# Altium project PCB_Project1.PrjPCB
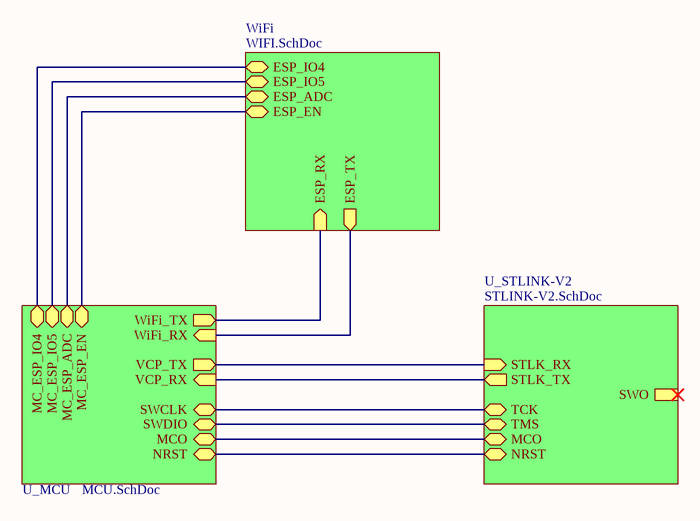
[diagram p0: Main.SchDoc]
4 sheets, 73 parts. Net scope: hierarchical (ports join the sheet entries above them; power ports are global).
Board file: PCB1.PcbDoc
Sheets:
  Main.SchDoc
    U_MCU = MCU.SchDoc
    U_STLINK-V2 = STLINK-V2.SchDoc
    WiFi = WIFI.SchDoc

## Sheet Main.SchDoc
size A

### Sub-sheets
U_MCU = MCU.SchDoc: VCP_TX (out), VCP_RX (in), SWCLK (bidir), SWDIO (bidir), MCO (bidir), NRST (bidir), WiFi_TX (out), WiFi_RX (in), MC_ESP_IO4 (bidir), MC_ESP_IO5 (bidir), MC_ESP_ADC (bidir), MC_ESP_EN (bidir)
U_STLINK-V2 = STLINK-V2.SchDoc: STLK_RX (in), STLK_TX (out), TCK (bidir), TMS (bidir), MCO (bidir), NRST (bidir), SWO
WiFi = WIFI.SchDoc: ESP_RX (in), ESP_TX (out), ESP_IO4 (bidir), ESP_IO5 (bidir), ESP_ADC (bidir), ESP_EN (bidir)

### Nets
MCO: sheet U_MCU/MCO, sheet U_STLINK-V2/MCO
PA9: sheet U_MCU/WiFi_TX, sheet WiFi/ESP_RX
PA10: sheet U_MCU/WiFi_RX, sheet WiFi/ESP_TX
STLINK RX: sheet U_MCU/VCP_TX, sheet U_STLINK-V2/STLK_RX
STLINK TX: sheet U_MCU/VCP_RX, sheet U_STLINK-V2/STLK_TX
NetC13_2: sheet U_MCU/NRST, sheet U_STLINK-V2/NRST
NetJ6_2: sheet U_MCU/MC_ESP_EN, sheet WiFi/ESP_EN
NetP3_18: sheet U_MCU/MC_ESP_ADC, sheet WiFi/ESP_ADC
NetP3_19: sheet U_MCU/MC_ESP_IO5, sheet WiFi/ESP_IO5
NetP3_20: sheet U_MCU/MC_ESP_IO4, sheet WiFi/ESP_IO4
NetR11_1: sheet U_MCU/SWCLK, sheet U_STLINK-V2/TCK
NetR14_2: sheet U_MCU/SWDIO, sheet U_STLINK-V2/TMS

## Sheet MCU.SchDoc
size A
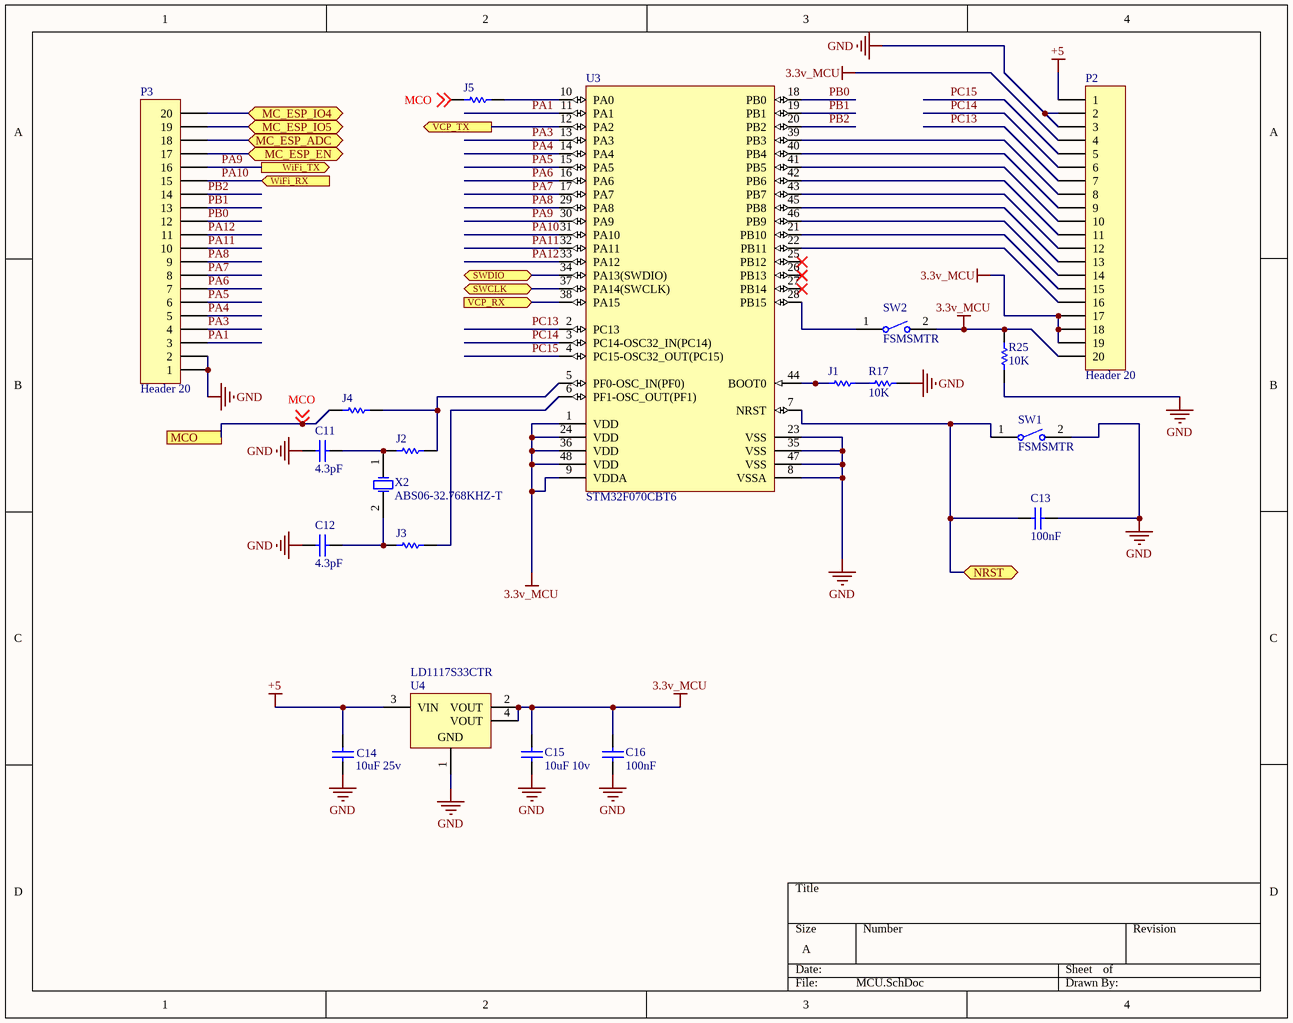
[diagram p1: MCU.SchDoc]

### Parts
C11  4.3pF  [CAPC0603(1608)100_L]
C12  4.3pF  [CAPC0603(1608)100_L]
C13  100nF  [CAPC0603(1608)100_L]
C14  10uF 25v  [CAPC0805(2012)145_L]
C15  10uF 10v  [CAPC0805(2012)145_L]
C16  100nF  [CAPC0603(1608)100_L]
J1  (no value)  [RESC1608X55X30LL10T20_A]
J2  (no value)  [RESC1608X55X30LL10T20_A]
J3  (no value)  [RESC1608X55X30LL10T20_A]
J4  (no value)  [RESC1608X55X30LL10T20_A]
J5  (no value)  [RESC1608X55X30LL10T20_A]
P2  Header 20  [HDR1X20]
P3  Header 20  [HDR1X20]
R17  10K  [RESC1609X55X30LL15T15]
R25  10K  [RESC1609X55X30LL15T15]
SW1  FSMSMTR  [TECO-FSMSMTR_V]
SW2  FSMSMTR  [TECO-FSMSMTR_V]
U3  STM32F070CBT6  [STM-LQFP48_N]
U4  LD1117S33CTR  [SOT-223_N]
X2  ABS06-32.768KHZ-T  [ABRA-ABS06-2_V]

### Ports
MC_ESP_ADC (bidir), MC_ESP_EN (bidir), MC_ESP_IO4 (bidir), MC_ESP_IO5 (bidir), MCO, NRST (bidir), SWCLK (bidir), SWDIO (bidir), VCP_RX (in), VCP_TX (out), WiFi_RX (in), WiFi_TX (out)

### Nets
3.3v_MCU: C15.2 C16.2 P2.4 P2.17 P2.18 P2.19 P2.20 R25.2 SW2.2 U3.1(VDD) U3.9(VDDA) U3.24(VDD) U3.36(VDD) U3.48(VDD) U4.2(VOUT) U4.4(VOUT)
+5: C14.2 P2.1 U4.3(VIN)
GND: C11.1 C12.1 C13.1 C14.1 C15.1 C16.1 P2.2 P2.3 P3.1 P3.2 R17.2 R25.1 SW1.2 U3.8(VSSA) U3.23(VSS) U3.35(VSS) U3.47(VSS) U4.1(GND)
MCO: J4.1 J5.1 ; off-sheet MCO, port MCO
PA1: P3.3 U3.11(PA1)
PA3: P3.4 U3.13(PA3)
PA4: P3.5 U3.14(PA4)
PA5: P3.6 U3.15(PA5)
PA6: P3.7 U3.16(PA6)
PA7: P3.8 U3.17(PA7)
PA8: P3.9 U3.29(PA8)
PA9: P3.16 U3.30(PA9) ; port WiFi_TX
PA10: P3.15 U3.31(PA10) ; port WiFi_RX
PA11: P3.10 U3.32(PA11)
PA12: P3.11 U3.33(PA12)
PB0: P3.12 U3.18(PB0)
PB1: P3.13 U3.19(PB1)
PB2: P3.14 U3.20(PB2)
PC13: P2.7 U3.2(PC13)
PC14: P2.6 U3.3(PC14-OSC32_IN(PC14))
PC15: P2.5 U3.4(PC15-OSC32_OUT(PC15))
STLINK RX: U3.12(PA2) ; port VCP_TX
STLINK TX: U3.38(PA15) ; port VCP_RX
NetC11_2: C11.2 J2.1 X2.1(X1)
NetC12_2: C12.2 J3.1 X2.2(X2)
NetC13_2: C13.2 SW1.1 U3.7(NRST) ; port NRST
NetJ1_1: J1.1 U3.44(BOOT0)
NetJ1_2: J1.2 R17.1
NetJ2_2: J2.2 J4.2 U3.5(PF0-OSC_IN(PF0))
NetJ3_2: J3.2 U3.6(PF1-OSC_OUT(PF1))
NetJ5_2: J5.2 U3.10(PA0)
NetJ6_2: P3.17 ; port MC_ESP_EN
NetP2_8: P2.8 U3.39(PB3)
NetP2_9: P2.9 U3.40(PB4)
NetP2_10: P2.10 U3.41(PB5)
NetP2_11: P2.11 U3.42(PB6)
NetP2_12: P2.12 U3.43(PB7)
NetP2_13: P2.13 U3.45(PB8)
NetP2_14: P2.14 U3.46(PB9)
NetP2_15: P2.15 U3.21(PB10)
NetP2_16: P2.16 U3.22(PB11)
NetP3_18: P3.18 ; port MC_ESP_ADC
NetP3_19: P3.19 ; port MC_ESP_IO5
NetP3_20: P3.20 ; port MC_ESP_IO4
NetR11_1: U3.37(PA14(SWCLK)) ; port SWCLK
NetR14_2: U3.34(PA13(SWDIO)) ; port SWDIO
NetSW2_1: SW2.1 U3.28(PB15)

Not connected (* = marked no-connect by the designer): U3 25(PB12)* 26(PB13)* 27(PB14)*

### Library data of the parts
C11 C12 = CMP-1035-00303-1: CAP 4.3pF 25V ±0.5pF 0603 (1608 Metric) Thickness 1mm SMD; Case-EIA: 0603; Tolerance: Â±0.5pF; Case-Metric: 1608; Value: 4.3pF; Technology: SMT; Max Thickness: 1 mm; Rated Voltage: 25 V
C13 C16 = CMP-1035-02583-1: CAP 100nF 16V ±5% 0603 (1608 Metric) Thickness 1mm SMD; Tolerance: Â±5%; Case-Metric: 1608; Case-EIA: 0603; Rated Voltage: 16 V; Max Thickness: 1 mm; Technology: SMT; Value: 100nF
C14 = CMP-1036-04932-1: CAP 10uF 25V ±10% 0805 (2012 Metric) Thickness 1.45mm SMD; Case-EIA: 0805; Case-Metric: 2012; Tolerance: Â±10%; Technology: SMT; Value: 10uF; Rated Voltage: 25 V; Max Thickness: 1.45 mm
C15 = CMP-1036-04926-1: CAP 10uF 10V -20% to +80% 0805 (2012 Metric) Thickness 1.45mm SMD; Case-EIA: 0805; Case-Metric: 2012; Technology: SMT; Max Thickness: 1.45 mm; Rated Voltage: 10 V; Value: 10uF; Tolerance: -20% to +80%
J1-J5 = CMP-2000-06686-1: Chip Resistor, 0 Ohm, +/- 5%, 100 mW, -55 to 155 degC, 0603 (1608 Metric), RoHS, Tape and Reel; Manufacturer: Rohm; Tolerance: Jumper; Power (Watts): 0.1W,1/10W; Resistance (Ohms): 0.0; Online Catalog: MCR03Series; EDA / CAD Models: DownloadfromAcceleratedDesigns; Other Names: RHM0.0CGTR; Series: MCR; Package Description: 2-Pin Surface Mount Device, Body 1.60 x 0.80 mm; Composition: ThickFilm; Height: 0.022"(0.55mm); Mounting Technology: SurfaceMount; Family: ChipResistor-SurfaceMount; Temperature Coefficient: -; Category: Resistors; Supplier Device Package: 0603(1608Metric); Package Reference: 0603; Size / Dimension: 0.063"Lx0.031"W(1.60mmx0.80mm); Standard Package: 5,000; Datasheet URL: http://www.rohm.com/web/global/datasheet/MCR03ERTJ; Features: -; Datasheet Version: Rev. F, 02/2015; Operating Temperature: -55°C~155°C; Package / Case: 0603(1608Metric); Manufacturer URL: http://www.rohm.com/web/global/; Packaging: Tape&Reel(TR); Number of Terminations: 2
P2 P3 = Header 20: Header, 20-Pin; LatestRevisionDate: 17-Jul-2002; LatestRevisionNote: Re-released for DXP Platform.; Publisher: Altium Limited
R17 R25 = CMP-2000-07452-1: Chip Resistor, 10 KOhm, +/- 1%, 0.1 W, -55 to 155 degC, 0603 (1608 Metric), RoHS, Tape and Reel; Manufacturer: Panasonic; Voltage Rating: 75V; Case\/Package: 0603; Power Rating: 100mW; Resistance: 10KOhm; Temperature Coefficient: 100ppm\/degreesC; Number of Pins: 2; Package Reference: 603; Depth: 0.8mm; Mount: SurfaceMount; Package Description: 2-Pin Surface Mount Device, Body 1.6 x 0.85 mm; Datasheet Version: 02/2017; Length: 1.6mm; Lead Free: LeadFree; Height: 0.45mm; Number of Terminations: 2; Max Power Dissipation: 100mW; Min Operating Temperature: -55degC; Datasheet URL: https://industrial.panasonic.com/cdbs/www-data/pdf/RDA0000/AOA0000C304.pdf; Termination: SMD/SMT; Case Code (Metric): 1608; Case Code (Imperial): 0603; Tolerance: 1%; Max Operating Temperature: 155degC; RoHSCompliant: true; Voltage Rating (DC): 75V; Radiation Hardening: No; Packaging: TapeandReel; Composition: ThickFilm; Mounting Technology: SurfaceMount; Manufacturer URL: http://www.panasonic.com/; Width: 0.031inch; REACH SVHC: NoSVHC; Contact Plating: Tin; Military Standard: Not; Package Quantity: 1
SW1 SW2 = CMP-2000-07501-1: FSMSM Push Button Switch, 50 mA, -35 to 85 degC, 2-Pin SMD, RoHS, Tape and Reel; Manufacturer: TE Connectivity; Voltage Rating (DC): 24V; Electrical Life: 20000Cycles; Operating Force: 180gf; Switch Travel: 0.25mm; Contact Current Rating: 50mA; Case\/Package: SMD/SMT; Actuator Length: 1.07mm; Throw Configuration: SPST; Actuator Material: Polyamide; Contact Resistance: 100mOhm; Illumination Type: Illuminated; Max Voltage Rating (DC): 12V; Manufacturer URL: http://www.te.com/; Lead Free: LeadFree; Packaging: TapeandReel; Min Operating Temperature: -35degC; Mechanical Life: 20000Cycles; Mount: SurfaceMount; REACH SVHC: Unknown; Package Quantity: 1800; Package Reference: FSMSMTR; RoHSCompliant: true; Max Operating Temperature: 85degC; Orientation: Straight; ELV: Compliant; Datasheet URL: http://www.te.com/commerce/DocumentDelivery/DDEController?Action=showdoc&DocId=Customer+Drawing%7F1437566-3%7FC2%7Fpdf%7FEnglish%7FENG_CD_1437566-3_C2_1437566_3_1_c.dwg.pdf%7F1437566-4; Package Description: 2-Pin Surface Mount Device, Body 6 x 3.5 mm, Pitch 9.19 mm; Current Rating: 50mA; Contact Plating: Silver; Termination: GullWing; Datasheet Version: Rev. C2, 08/2014; Contact Material: Brass; Mounting Technology: SurfaceMount
U3 = CMP-0304-00143-1: ARM Cortex-M0 32-bit MCU, 128 KB Flash, 16 KB Internal RAM, 37 I/Os, 48-Pin LQFP, -40 to 85 degC, Tray; I/Os (High Current): 37; FLASH Size (Prog) (kB): 128; Operating Frequency(F) (Processor speed) (MHz): 48; Internal RAM Size (kB): 16; Supply Voltage(Vcc) min (V): 2.4; Package Description: 48-Pin Low Profile Quad Flat Package, Body 7 x 7 mm, Pitch 0.5 mm; Mounting Technology: Surface Mount; DatasheetVersion: Rev. 3; ComponentLink1Description: Manufacturer URL; Package Reference: LQFP48; Core: ARM Cortex-M0; ComponentLink1URL: http://www.st.com/; Packing: Tray; ComponentLink2Description: Datasheet; ComponentLink2URL: http://www.st.com/st-web-ui/static/active/en/resource/technical/document/datasheet/DM00141386.pdf
U4 = CMP-0244-00307-1: Fixed Low Drop Positive Voltage Regulator, 3.3V, 4-Pin SOT-223, Tape and Reel; ComponentLink1URL: http://www.st.com; PackageVersion: 2010; ComponentLink1Description: Manufacturer URL; DatasheetVersion: 1/11/2011; ComponentLink2URL: http://www.st.com/internet/com/TECHNICAL_RESOURCES/TECHNICAL_LITERATURE/DATASHEET/CD00000544.pdf; PackageReference: SOT-223; ComponentLink2Description: Datasheet; PackageDescription: 4-Pin SOT-223 Package, 6.5 x 3.5 mm Body, 2.3 mm Pitch, 7 mm Lead Span
X2 = CMP-2000-05035-1: Low Profile Crystal, 32.768 KHz, -40 to 85 degC, 2-Pin SMD, RoHS, Tape and Reel; Brand: ABRACON; Tolerance: 20PPM; Case Height: 0.6mm; Case Length: 2mm; Case Width: 1.2mm; ESR: 90kOhms; Load Capacitance: 12.5pF; Series: ABS06; Manufacturer URL: http://www.abracon.com/; RoHS: Details; Datasheet URL: http://www.mouser.com/ds/2/3/ABS06-10798.pdf; Package / Case: 2-SMD; Mounting Style: SMD/SMT; Type: LowProfileCrystal; Product Category: Crystals; Datasheet Version: Sep-15; Frequency Stability: 20PPM; Packaging: Reel; Frequency: 32.768kHz; Operating Temperature Range: -40Cto+85C; Package Description: 2-Pin Surface Mounted Device, Body 2 x 1.2 mm, Height 0.6 mm; Dimensions: 1.2mmWx2mmLx0.6mmH; Package Reference: ABS06; Manufacturer: ABRACON; Termination Style: SMD/SMT; Factory Pack Quantity: 3000

## Sheet STLINK-V2.SchDoc
size A
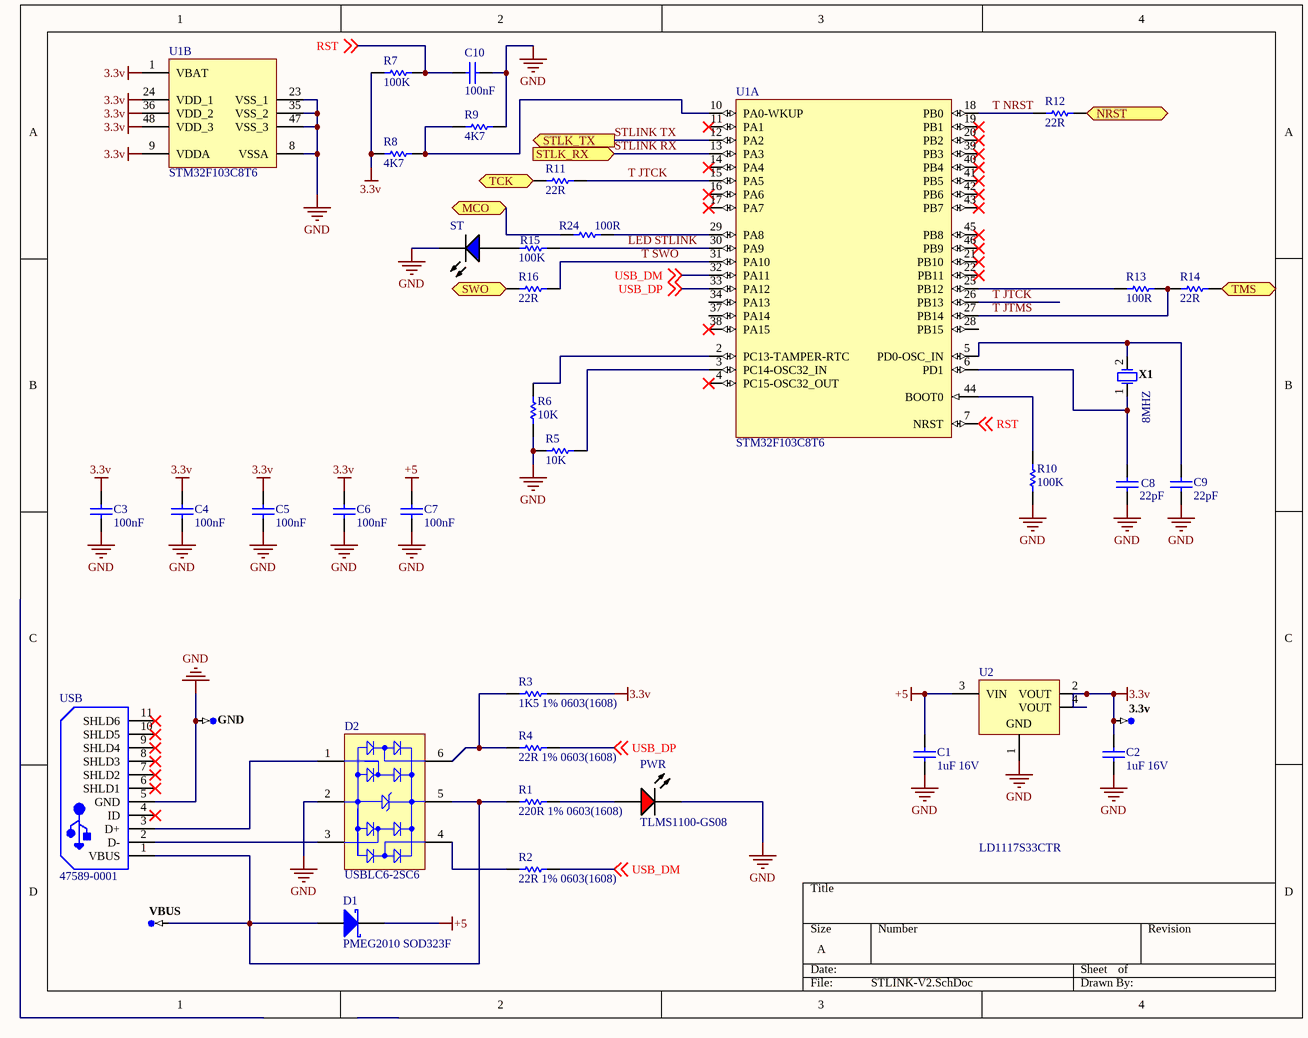
[diagram p2: STLINK-V2.SchDoc]

### Parts
3.3v  (no value)  [TP-SM-C-100]  (no BOM)
C1  1uF 16V  [CAPC0603(1608)100_L]
C2  1uF 16V  [CAPC0603(1608)100_L]
C3  100nF  [CAPC0603(1608)100_L]
C4  100nF  [CAPC0603(1608)100_L]
C5  100nF  [CAPC0603(1608)100_L]
C6  100nF  [CAPC0603(1608)100_L]
C7  100nF  [CAPC0603(1608)100_L]
C8  22pF  [CAPC0603(1608)100_L]
C9  22pF  [CAPC0603(1608)100_L]
C10  100nF  [CAPC0603(1608)100_L]
D1  PMEG2010 SOD323F  [NXP-SOD323F_V]
D2  USBLC6-2SC6  [STM-SOT23-6L_V]
GND  (no value)  [TP-SM-C-100]  (no BOM)
PWR  TLMS1100-GS08  [VISH-TLMX1100_V]
R1  220R 1% 0603(1608)  [RESC0603(1608)_L]
R2  22R 1% 0603(1608)  [RESC0603(1608)_L]
R3  1K5 1% 0603(1608)  [RESC0603(1608)_L]
R4  22R 1% 0603(1608)  [RESC0603(1608)_L]
R5  10K  [RESC1609X55X30LL15T15]
R6  10K  [RESC1609X55X30LL15T15]
R7  100K  [RESC0603(1608)_L]
R8  4K7  [RESC0603(1608)_L]
R9  4K7  [RESC0603(1608)_L]
R10  100K  [RESC0603(1608)_L]
R11  22R  [RESC0603(1608)_L]
R12  22R  [RESC0603(1608)_L]
R13  100R  [RESC0603(1608)_L]
R14  22R  [RESC0603(1608)_L]
R15  100K  [RESC0603(1608)_L]
R16  22R  [RESC0603(1608)_L]
R24  100R  [RESC0603(1608)_L]
ST  (no value)  [ROHM-SMLE12BC7TT86_V]
U1  STM32F103C8T6  [LQFP48_N]  (parts A,B of 2)
U2  LD1117S33CTR  [SOT-223_N]
USB  47589-0001  [MOLX-47589-0001_V]
VBUS  (no value)  [TP-SM-C-100]  (no BOM)
X1  8MHZ  [NDK-NX3225GD-8MHZ-STD-CRA-3_V]

### Ports
MCO (bidir), NRST (bidir), STLK_RX (in), STLK_TX (out), SWO (bidir), TCK (bidir), TMS (bidir)

### Nets
3.3v: 3.3v.1 C2.2 C3.2 C4.2 C5.2 C6.2 R3.2 R7.1 R8.1 U1.1(VBAT) U1.9(VDDA) U1.24(VDD_1) U1.36(VDD_2) U1.48(VDD_3) U2.2(VOUT) U2.4(VOUT)
+5: C1.2 C7.2 D1.1(K) U2.3(VIN)
GND: C1.1 C2.1 C3.1 C4.1 C5.1 C6.1 C7.1 C8.1 C9.1 C10.1 D2.2(GND) GND.1 PWR.2(K) R5.1 R6.1 R9.2 R10.1 ST.2(K) U1.8(VSSA) U1.23(VSS_1) U1.35(VSS_2) U1.47(VSS_3) U2.1(GND) USB.5(GND)
LED STLINK: R15.2 U1.30(PA9)
MCO: R24.1 ; port MCO
RST: C10.2 R7.2 U1.7(NRST) ; off-sheet RST
STLINK RX: U1.13(PA3) ; port STLK_RX
STLINK TX: U1.12(PA2) ; port STLK_TX
T JTCK: R11.2 U1.15(PA5) U1.26(PB13)
T JTMS: R13.2 R14.1 U1.27(PB14)
T NRST: R12.1 U1.18(PB0)
T SWO: R16.2 U1.31(PA10)
USB_DM: R2.2 U1.32(PA11) ; off-sheet USB_DM
USB_DP: R4.2 U1.33(PA12) ; off-sheet USB_DP
NetC8_2: C8.2 U1.6(PD1) X1.1
NetC9_2: C9.2 U1.5(PD0-OSC_IN) X1.2
NetC13_2: R12.2 ; port NRST
NetD1_2: D1.2(A) D2.5(VBUS) R1.1 USB.1(VBUS) VBUS.1
NetD2_1: D2.1(I/O_1) USB.3(D+)
NetD2_3: D2.3(I/O_2) USB.2(D-)
NetD2_4: D2.4(I/O_3) R2.1
NetD2_6: D2.6(I/O_4) R3.1 R4.1
NetPWR_1: PWR.1(A) R1.2
NetR5_2: R5.2 U1.3(PC14-OSC32_IN)
NetR6_2: R6.2 U1.2(PC13-TAMPER-RTC)
NetR8_2: R8.2 R9.1 U1.10(PA0-WKUP)
NetR10_2: R10.2 U1.44(BOOT0)
NetR11_1: R11.1 ; port TCK
NetR13_1: R13.1 U1.25(PB12)
NetR14_2: R14.2 ; port TMS
NetR15_1: R15.1 ST.1(A)
NetR16_1: R16.1 ; port SWO
NetR24_2: R24.2 U1.29(PA8)

Not connected (* = marked no-connect by the designer): U1 4(PC15-OSC32_OUT)* 11(PA1)* 14(PA4)* 16(PA6)* 17(PA7)* 19(PB1)* 20(PB2)* 21(PB10)* 22(PB11)* 28(PB15) 34(PA13) 37(PA14) 38(PA15)* 39(PB3)* 40(PB4)* 41(PB5)* 42(PB6)* 43(PB7)* 45(PB8)* 46(PB9)*; USB 4(ID)* 6(SHLD1)* 7(SHLD2)* 8(SHLD3)* 9(SHLD4)* 10(SHLD5)* 11(SHLD6)*

### Library data of the parts
3.3v GND VBUS = CMP-0484-00002-2: Test Point, Surface Mount, Circular, Pad Diameter 1 mm; Manufacturer: No Vendor; PartNumber: TP-SM-C-100
C1 C2 = CMP-1035-02736-1: CAP 1uF 16V ±5% 0603 (1608 Metric) Thickness 1mm SMD; Case-Metric: 1608; Case-EIA: 0603; Tolerance: Â±5%; Technology: SMT; Max Thickness: 1 mm; Rated Voltage: 16 V; Value: 1uF
C3-C7 C10 = CMP-1035-02583-1: as C13 on sheet MCU; Rated Voltage: 16 V; Max Thickness: 1 mm; Technology: SMT; Value: 100nF
C8 C9 = CMP-1035-00815-1: CAP 22pF 25V ±10% 0603 (1608 Metric) Thickness 1mm SMD; Case-Metric: 1608; Case-EIA: 0603; Tolerance: Â±10%; Max Thickness: 1 mm; Rated Voltage: 25 V; Technology: SMT; Value: 22pF
D1 = CMP-2000-06909-1: Very Low Forward Voltage MEGA Schottky Barrier Rectifier, 1 A, 660 mV, -65 to 150 degC, 2-Pin SOD323F, RoHS, Tape and Reel; Manufacturer: NXP; Speed: FastRecovery=200mA(Io); Package Version: 02/2016; Capacitance @ Vr, F: 68pF@1V,1MHz; PCN Design/Specification: ResinHardener02/Jul/2013BondWiringChg06/Sep/2015BondingWireRevision28/Sep/2015SOD323FBondWireAutoCu&2ndSourceMoldComp2/Nov/2015; Current - Average Rectified (Io): 1A(DC); Other Names: 568-4138-1; Voltage - Forward (Vf) (Max) @ If: 660mV@1A; Current - Reverse Leakage @ Vr: 50µA@60V; Online Catalog: SchottkyDiode; Kits: NXPMEGA1-KIT-ND-KITSCHOTTKYDIODE17VALUES; PCN Packaging: LighterReels02/Jan/2014; Voltage - DC Reverse (Vr) (Max): 60V; Diode Type: Schottky; Package Description: 2-Pin Small Outline Diode Flat Lead, Body 1.7 x 1.35 mm; Datasheet URL: https://datasheet.ciiva.com/913/pmeg6010ceh-pmeg6010cej-913504.pdf; Mounting Technology: SurfaceMount; Package Reference: SOD323F; Packaging: CutTape(CT); Manufacturer URL: http://www.nxp.com/; Supplier Device Package: SOD-323F; Reverse Recovery Time (trr): -; Standard Package: 1; Category: DiscreteSemiconductorProducts; Family: Diodes,Rectifiers-Single; Mounting Type: SurfaceMount; Datasheet Version: Rev. 02, 03/2007; Operating Temperature - Junction: 150°C(Max); Series: -; Package / Case: SC-90,SOD-323F; Package URL: http://www.nxp.com/documents/outline_drawing/SOD323F.pdf
D2 = CMP-2000-05378-1: Very low capacitance ESD protection, 3.5 pF, -40 to 125 degC, 6-Pin SOT23, RoHS, Tape and Reel; Manufacturer: STMicroelectronics; Polarity: Uni-Directional; Clamping Voltage: 17V; Rad Hardened: No; Product Height (mm): 1.3mm; Leakage Current (Max): 0.15uA; Product Length (mm): 3.05mm; Number of Elements: 1; Peak Pulse Current: 5A; Configuration: Dual; Reverse Breakdown Voltage: 6V; Working Voltage (Max): 5V; Capacitance Value: 3.5pF; Suppressor Type: DiodeArrays; Product Depth (mm): 1.75mm; Test Current (It): 1mA; Package / Case: SOT-23; Operating Temperature Max Deg. C: 125C; Package Description: 6-Pin Small Outline Transistor, Body 2.925 x 1.625 mm, Pitch 0.95 mm; Package Reference: SOT23-6L; Datasheet Version: Rev. 5, 10/2011; Operating Temperature Min Deg. C: -40C; Mounting Style: SurfaceMount; Direction Type: Uni-Directional; Mounting: SurfaceMount; Pin Count: 6; Leakage Current: 0.15uA; Packaging: TapeandReel; Operating Temperature Classification: Automotive; Clamping Voltage (Max): 17V; Manufacturer URL: http://www.st.com/; Reverse Stand-off Voltage: 5V; Datasheet URL: http://www.st.com/st-web-ui/static/active/en/resource/technical/document/datasheet/CD00050750.pdf; Working Voltage: 5V; Operating Temp Range: -40Cto125C
PWR = CMP-1666-00027-1: LED, RED, 2.1 V, -40 to 100 degC, 2-Pin SMD (0603), RoHS, Tape and Reel; Type (Capacitors): C0G; Resistance: 100000000000 Ohm; Capacitance: 12 pF; Voltage Rating: 50 V; Tolerance: 5%; Min Operating Temperature: -55degC; REACH SVHC: No SVHC; ComponentLink2Description: Datasheet; ComponentLink1URL: http://www.vishay.com/; Width: 0.8 mm; Package Quantity: 4000; PackageReference: TLMX1100; ComponentLink2URL: http://www.vishay.com/docs/83173/tlmb1100.pdf; Case/Package: 0603; Case Code (Metric): 1608; Packaging: Tape and Reel; Pins: 2; ComponentLink1Description: Manufacturer URL; Max Operating Temperature: 125degC; Height: 0.8 mm; Length: 1.6 mm; Mount: Surface Mount; PackageDescription: 2-Pin Surface Mount Device, Body 1.6 x 0.8 mm; DatasheetVersion: Rev. 2.7, 03/2016; Case Code (Imperial): 0603; Voltage Rating (DC): 50 V; RoHSCompliant: True; Radiation Hardening: No
R1 = CMP-1012-00433-1: 220R 0.1W 1% 0603 (1608 Metric)  SMD; Value: 220.00 Ohm; Case-EIA: 0603; Case-Metric: 1608; Technology: SMT; Tolerance: 1 %; Power: 0.1 W
R2 R4 R11 R12 R14 R16 = CMP-1012-00320-1: 22R 0.1W 1% 0603 (1608 Metric)  SMD; Value: 22.00 Ohm; Case-EIA: 0603; Case-Metric: 1608; Power: 0.1 W; Technology: SMT; Tolerance: 1 %
R3 = CMP-1012-00528-1: 1K5 0.1W 1% 0603 (1608 Metric)  SMD; Case-EIA: 0603; Value: 1500.00 Ohm; Case-Metric: 1608; Power: 0.1 W; Technology: SMT; Tolerance: 1 %
R5 R6 = CMP-2000-07452-1: as R17 on sheet MCU; Number of Pins: 2; Package Reference: 603; Depth: 0.8mm; Mount: SurfaceMount; Package Description: 2-Pin Surface Mount Device, Body 1.6 x 0.85 mm; Datasheet Version: 02/2017; Length: 1.6mm; Lead Free: LeadFree; Height: 0.45mm; Number of Terminations: 2; Max Power Dissipation: 100mW; Min Operating Temperature: -55degC; Datasheet URL: https://industrial.panasonic.com/cdbs/www-data/pdf/RDA0000/AOA0000C304.pdf; Termination: SMD/SMT; Case Code (Metric): 1608; Case Code (Imperial): 0603; Tolerance: 1%; Max Operating Temperature: 155degC; RoHSCompliant: true; Voltage Rating (DC): 75V; Radiation Hardening: No; Packaging: TapeandReel; Composition: ThickFilm; Mounting Technology: SurfaceMount; Manufacturer URL: http://www.panasonic.com/; Width: 0.031inch; REACH SVHC: NoSVHC; Contact Plating: Tin; Military Standard: Not; Package Quantity: 1
R7 R10 R15 = CMP-1012-00736-1: 100K 0.1W 1% 0603 (1608 Metric)  SMD; Value: 100000.00 Ohm; Case-Metric: 1608; Case-EIA: 0603; Power: 0.1 W; Tolerance: 1 %; Technology: SMT
R8 R9 = CMP-1012-00586-1: 4K7 0.1W 1% 0603 (1608 Metric)  SMD; Case-EIA: 0603; Case-Metric: 1608; Value: 4700.00 Ohm; Power: 0.1 W; Tolerance: 1 %; Technology: SMT
R13 R24 = CMP-1012-00397-1: 100R 0.1W 1% 0603 (1608 Metric)  SMD; Value: 100.00 Ohm; Case-EIA: 0603; Case-Metric: 1608; Technology: SMT; Tolerance: 1 %; Power: 0.1 W
ST = CMP-2000-07118-1: Blue LED, 2.9 V, 20 mA, -30 to 85 degC, 2-Pin SMD, RoHS, Tape and Reel; Manufacturer: Rohm; Lens Type: Clear; Viewing Angle: 140°; Forward Voltage: 2.9V; Forward (Drive) Current: 20mA; Intensity: 22mcd; Datasheet Version: Rev. 2.0, 03/2010; Package Description: 2-Pin Surface Mount Device, Body 1.6 x 0.8 mm; Mounting Technology: SurfaceMount; Dimension: 1.6x0.8x0.36mm; Package Reference: 1608; Datasheet URL: https://datasheet.ciiva.com/11773/0900766b80df3ad8-11773825.pdf; Color: Blue; Manufacturer URL: http://www.rohm.com/web/global/
U1 = CMP-0237-00215-1: STM32 ARM-based 32-bit MCU Performance Line with 64 kB Flash, 20 kB Internal RAM, -40 to +85°C Temperature, 48-Pin LQFP, Tray; ComponentLink2Description: STM32 Family Web Page; PackageReference: LQFP48; ComponentLink1Description: STM32F103 Datasheet; ComponentLink2URL: www.st.com/stm32; PackageDescription: 48-Pin Low-Profile Quad Flat Pack, 7 x 7 mm Body, 0.5 mm Pitch (LQFP48); DatasheetVersion: rev13.0, Apr-2011; ComponentLink1URL: http://www.st.com/internet/com/TECHNICAL_RESOURCES/TECHNICAL_LITERATURE/DATASHEET/CD00161566.pdf; ComponentLink3Description: st.com Home; ComponentLink3URL: http://www.st.com/internet/com/home/home.jsp; PackageVersion: rev13, Apr-2011; PartId: 1
U2 = CMP-0244-00307-1: as U4 on sheet MCU; ComponentLink1URL: http://www.st.com; PackageVersion: 2010; ComponentLink1Description: Manufacturer URL; DatasheetVersion: 1/11/2011; ComponentLink2URL: http://www.st.com/internet/com/TECHNICAL_RESOURCES/TECHNICAL_LITERATURE/DATASHEET/CD00000544.pdf; PackageReference: SOT-223; ComponentLink2Description: Datasheet; PackageDescription: 4-Pin SOT-223 Package, 6.5 x 3.5 mm Body, 2.3 mm Pitch, 7 mm Lead Span
USB = CMP-2000-05610-1: Right Angle Female Type AB Micro USB Connector, 30 V, 1.8 A, -30 to 85 degC, RoHS, Tape and Reel; Number of Ports: 1Port; Current Rating: 1.8A; Brand: Molex; Connector Type: MicroUSBTypeABreceptacle; Number of Contacts: 5Contact; Voltage Rating: 30VAC; Color: Black; Product: MicroUSBTypeABConnectors; Package URL: http://www.molex.com/pdm_docs/sd/475890001_sd.pdf; Contact Plating: Gold; Datasheet URL: http://www.molex.com/webdocs/datasheets/pdf/en-us/0475890001_IO_CONNECTORS.pdf; Operating Temperature Range: -20Cto+85C; Termination Style: SMD/SMT; Mounting Angle: Right; Package Reference: 47589-0001; Gender: Female; Package Description: Micro USB Connector, Pitch 0.65 mm, 5 Positions, Body 7.5 x 5.6 mm; Mounting Technology: SurfaceMount; Contact Material: CopperAlloy; Packaging: Reel; RoHS: True; Standard: USB; Manufacturer URL: http://www.molex.com/; Manufacturer: Molex; Datasheet Version: 12/2016; Product Category: USBConnectors; Series: 47589
X1 = CMP-2000-07595-1: Crystal Unit, 8 MHz, 8 pF, -40 to 150 degC, 2-Pin SMD, RoHS, Tape and Reel; Manufacturer: NDK; Load Capacitance: 8pF; ESR (Equivalent Series Resistance): 500Ohm; Frequency Tolerance: 50ppm; Frequency Stability: 150ppm; Case/Package: SMD/SMT; Datasheet Version: 11/2016; Min Operating Temperature: -40degC; Packaging: TapeandReel; Width: 0.098inch; Package Quantity: 3000; Number of Pins: 2; Package Description: 2-Pin Surface Mount Device, Body 3.2 x 2.5 mm; RoHSCompliant: True; Package Reference: NX3225GD-8MHZ-STD-CRA-3; Datasheet URL: http://www.ndk.com/images/products/catalog/c_NX3225GD-STD-CRA-3_e.pdf; Mounting Technology: SurfaceMount; Length: 0.126inch; Mount: SurfaceMount; Manufacturer URL: http://www.ndk.com/en/; Max Operating Temperature: 150degC; Frequency: 8MHz; Height: 0.039inch

## Sheet WIFI.SchDoc
size A
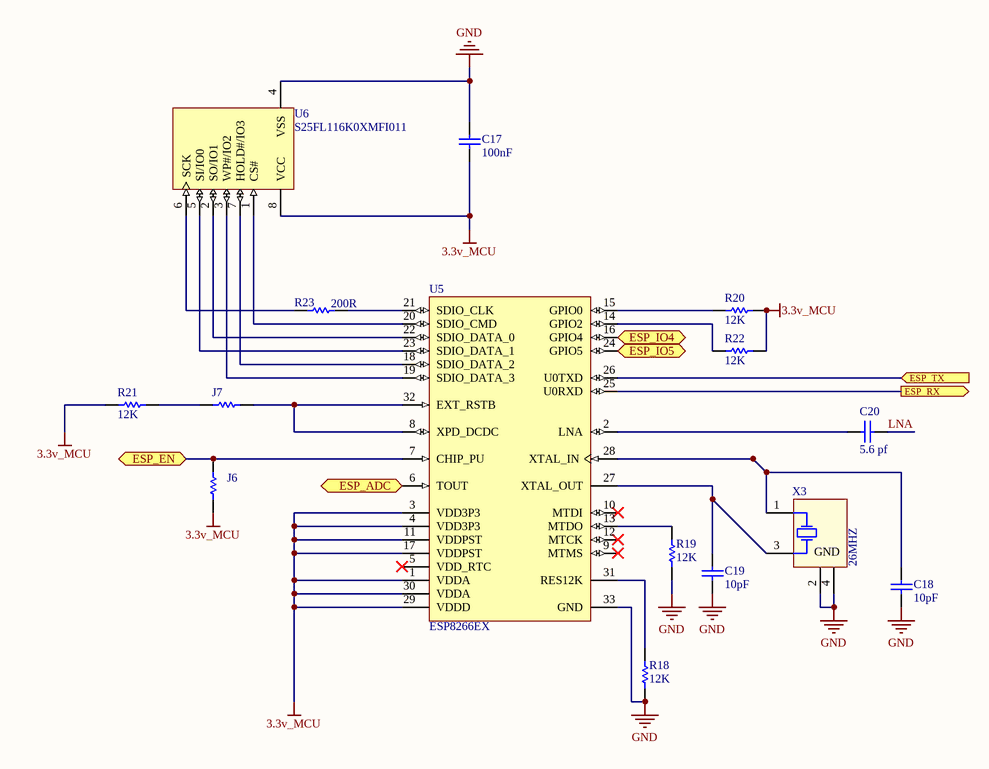
[diagram p3: WIFI.SchDoc]

### Parts
C17  100nF  [CAPC0603(1608)100_L]
C18  10pF  [CAPC0603(1608)100_L]
C19  10pF  [CAPC0603(1608)100_L]
C20  5.6 pf  [CAPC0603(1608)100_L]
J6  (no value)  [RESC1608X55X30LL10T20_A]
J7  (no value)  [RESC1608X55X30LL10T20_A]
R18  12K  [RESC1609X55X30LL15T15]
R19  12K  [RESC1609X55X30LL15T15]
R20  12K  [RESC1609X55X30LL15T15]
R21  12K  [RESC1609X55X30LL15T15]
R22  12K  [RESC1609X55X30LL15T15]
R23  200R  [RESC0603(1608)_L]
U5  ESP8266EX  [ESFS-QFN-32_M]
U6  S25FL116K0XMFI011  [CYP-SOC-8_L]
X3  26MHZ  [NDK-NX2016SA-26MHZ-EXS00A-CS06025-4_V]

### Ports
ESP_ADC (bidir), ESP_EN (bidir), ESP_IO4 (bidir), ESP_IO5 (bidir), ESP_RX (out), ESP_TX (in)

### Nets
3.3v_MCU: C17.2 J6.1 R20.1 R21.2 R22.1 U5.1(VDDA) U5.3(VDD3P3) U5.4(VDD3P3) U5.11(VDDPST) U5.17(VDDPST) U5.29(VDDD) U5.30(VDDA) U6.8(VCC)
GND: C17.1 C18.1 C19.1 R18.1 R19.1 U5.33(GND) U6.4(VSS) X3.2(GND) X3.4(GND)
LNA: C20.2
PA9: U5.25(U0RXD) ; port ESP_RX
PA10: U5.26(U0TXD) ; port ESP_TX
NetC18_2: C18.2 U5.28(XTAL_IN) X3.1(X1)
NetC19_2: C19.2 U5.27(XTAL_OUT) X3.3(X2)
NetC20_1: C20.1 U5.2(LNA)
NetJ6_2: J6.2 U5.7(CHIP_PU) ; port ESP_EN
NetJ7_1: J7.1 U5.8(XPD_DCDC) U5.32(EXT_RSTB)
NetJ7_2: J7.2 R21.1
NetP3_18: U5.6(TOUT) ; port ESP_ADC
NetP3_19: U5.24(GPIO5) ; port ESP_IO5
NetP3_20: U5.16(GPIO4) ; port ESP_IO4
NetR18_2: R18.2 U5.31(RES12K)
NetR19_2: R19.2 U5.13(MTDO)
NetR20_2: R20.2 U5.15(GPIO0)
NetR22_2: R22.2 U5.14(GPIO2)
NetR23_1: R23.1 U6.6(SCK)
NetR23_2: R23.2 U5.21(SDIO_CLK)
NetU5_18: U5.18(SDIO_DATA_2) U6.7(HOLD#/IO3)
NetU5_19: U5.19(SDIO_DATA_3) U6.3(WP#/IO2)
NetU5_20: U5.20(SDIO_CMD) U6.1(CS#)
NetU5_22: U5.22(SDIO_DATA_0) U6.2(SO/IO1)
NetU5_23: U5.23(SDIO_DATA_1) U6.5(SI/IO0)

Not connected (* = marked no-connect by the designer): U5 5(VDD_RTC)* 9(MTMS)* 10(MTDI)* 12(MTCK)*

### Library data of the parts
C17 = CMP-1035-02583-1: as C13 on sheet MCU; Rated Voltage: 16 V; Max Thickness: 1 mm; Technology: SMT; Value: 100nF
C18 C19 = CMP-1035-00542-1: CAP 10pF 16V ±1% 0603 (1608 Metric) Thickness 1mm SMD; Tolerance: Â±1%; Case-EIA: 0603; Case-Metric: 1608; Value: 10pF; Rated Voltage: 16 V; Technology: SMT; Max Thickness: 1 mm
C20 = CMP-1035-00372-1: CAP 5.6pF 25V ±0.1pF 0603 (1608 Metric) Thickness 1mm SMD; Case-Metric: 1608; Tolerance: Â±0.1pF; Case-EIA: 0603; Value: 5.6pF; Rated Voltage: 25 V; Max Thickness: 1 mm; Technology: SMT
J6 J7 = CMP-2000-06686-1: as J1 on sheet MCU; Series: MCR; Package Description: 2-Pin Surface Mount Device, Body 1.60 x 0.80 mm; Composition: ThickFilm; Height: 0.022"(0.55mm); Mounting Technology: SurfaceMount; Family: ChipResistor-SurfaceMount; Temperature Coefficient: -; Category: Resistors; Supplier Device Package: 0603(1608Metric); Package Reference: 0603; Size / Dimension: 0.063"Lx0.031"W(1.60mmx0.80mm); Standard Package: 5,000; Datasheet URL: http://www.rohm.com/web/global/datasheet/MCR03ERTJ; Features: -; Datasheet Version: Rev. F, 02/2015; Operating Temperature: -55°C~155°C; Package / Case: 0603(1608Metric); Manufacturer URL: http://www.rohm.com/web/global/; Packaging: Tape&Reel(TR); Number of Terminations: 2
R18-R22 = CMP-2100-03631-1: Chip Resistor, 12 KOhm, +/- 1%, 0.1 W, -55 to 155 degC, 0603 (1608 Metric), RoHS, Tape and Reel; Manufacturer: Panasonic; Power Rating: 100mW; Temperature Coefficient: 100ppm/degreesC; Voltage Rating (DC): 75V; Resistance: 12KOhm; REACH SVHC: NoSVHC; Composition: ThickFilm; Case/Package: 0603; RoHSCompliant: true; Package URL: http://www.st.com/st-web-ui/static/active/en/resource/technical/document/datasheet/CD00001320.pdf; Radiation Hardening: No; Height: 0.022inch; Termination: SMD/SMT; Number of Pins: 2; Package Description: 2-Pin Surface Mount Device, Body 1.6 x 0.85 mm; Datasheet URL: https://industrial.panasonic.com/cdbs/www-data/pdf/RDA0000/AOA0000C283.pdf; Width: 0.031inch; Length: 1.6mm; Datasheet Version: 42095.0; Manufacturer URL: http://www.panasonic.com/; Number of Terminations: 2; Case Code (Imperial): 0603; Depth: 0.8mm; Package Quantity: 1; Package Reference: 0603; Case Code (Metric): 1608; Lead Free: LeadFree; Military Standard: Not; Max Power Dissipation: 100mW; Min Operating Temperature: -55degC; Max Operating Temperature: 155degC; Contact Plating: Tin; Voltage Rating: 75V; Weight: 7.1E-05oz; Mount: SurfaceMount; Packaging: TapeandReel; Tolerance: 1%
R23 = CMP-1012-00429-1: 200R 0.1W 1% 0603 (1608 Metric)  SMD; Value: 200.00 Ohm; Case-EIA: 0603; Case-Metric: 1608; Tolerance: 1 %; Technology: SMT; Power: 0.1 W
U5 = CMP-2000-07453-1: Low-Power, Highly-Integrated Wi-Fi Solution, 2.5 to 3.6 V, 80 mA, -40 to 125 degC, 32-Pin QFN; Manufacturer: Espressif Systems; Mounting Technology: SurfaceMount; Datasheet URL: http://espressif.com/sites/default/files/documentation/0a-esp8266ex_datasheet_en.pdf; Package Reference: QFN-32; Package Description: 32-Pin Quad Falt No-Lead, Body 5 x 5 mm, Pitch 0.5 mm; Manufacturer URL: http://espressif.com; Datasheet Version: Rev. 5.4, 04/2017
U6 = CMP-2000-07015-1: SPI Flash Memory, 16 Mbit, 2.7 to 3.6 V, -40 to 85 degC, 8-Pin SOIC, RoHS, Tube; Manufacturer: CypressSemiconductorCorp; Memory Type: FLASH-NOR; Interface: SPISerial; Speed: 108MHz; Voltage - Supply: 2.7V~3.6V; Memory Size: 16M(2Mx8); Supplier Device Package: 8-SO; Family: Memory; Manufacturer URL: http://www.cypress.com/; Format - Memory: FLASH; Series: FL1-K; Category: IntegratedCircuits(ICs); Datasheet Version: Rev. *E, 06/2016; Package Description: 8-Pin Small Outline Integrated Circuit, Body 5.283 x 5.283 mm, Pitch 1.27 mm; Operating Temperature: -40°C~85°C(TA); Mounting Technology: SurfaceMount; Packaging: Tube; Package / Case: 8-SOIC(0.209",5.30mmWidth); Package Reference: SOIC-8; Datasheet URL: http://www.cypress.com/file/196886/download
X3 = CMP-0454-00001-2: Crystal, 26 MHz, 8 pF, for OA / AV / Short-range Wireless, -10 to 75 degC, 2.0 x 1.6 x 0.45 mm SMD; PartNumber: NX2016SA-26MHZ-EXS00A-CS06025; Manufacturer: NDK; Level of drive: 10 uW (Max. 200 uW); Overtone Order: Fundamental; Load Capacitance: 8 pF; Operating Temperature: -10 to 75 degC; ComponentLink1Description: Manufacturer URL; ComponentLink3Description: Package Specification; ComponentLink3URL: http://www.ndk.com/images/products/catalog/c_NX2016SA-STD-CZS-1_e.pdf; PackageDescription: 4-Pin Hand Drawn, Body 2x1.6mm; Storage temperature range: -40 to 85 degC; ComponentLink1URL: https://www.ndk.com; Mounting Technology: Surface Mount; Nominal Frequency: 26 MHz; PackageReference: NX2016SA-26MHZ-EXS00A-CS06025-4; ComponentLink2Description: Datasheet; ComponentLink2URL: http://www.ndk.com/images/products/catalog/c_NX2016SA-STD-CZS-1_e.pdf

## Nets that join several sheets
3.3v_MCU: MCU (16 pins), WIFI (13 pins)
+5: MCU (C14.2 P2.1 U4.3), STLINK-V2 (C1.2 C7.2 D1.1 U2.3)
GND: MCU (18 pins), STLINK-V2 (24 pins), WIFI (9 pins)
MCO: MCU (J4.1 J5.1), STLINK-V2 (R24.1)
NetC13_2: MCU (C13.2 SW1.1 U3.7), STLINK-V2 (R12.2)
NetJ6_2: MCU (P3.17), WIFI (J6.2 U5.7)
NetP3_18: MCU (P3.18), WIFI (U5.6)
NetP3_19: MCU (P3.19), WIFI (U5.24)
NetP3_20: MCU (P3.20), WIFI (U5.16)
NetR11_1: MCU (U3.37), STLINK-V2 (R11.1)
NetR14_2: MCU (U3.34), STLINK-V2 (R14.2)
PA9: MCU (P3.16 U3.30), WIFI (U5.25)
PA10: MCU (P3.15 U3.31), WIFI (U5.26)
STLINK RX: MCU (U3.12), STLINK-V2 (U1.13)
STLINK TX: MCU (U3.38), STLINK-V2 (U1.12)